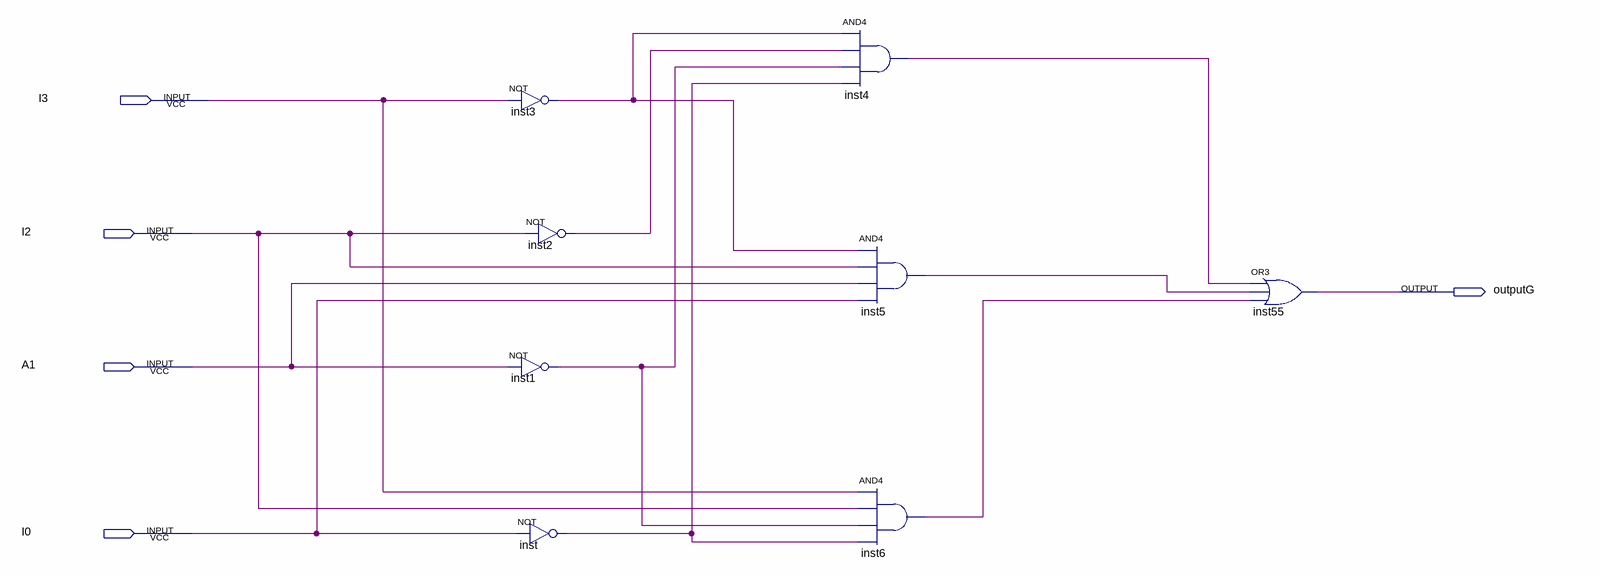
[diagram p0: schematic sheet]
// Quartus schematic outputG.bdf as structural Verilog: 8 symbols, 5 pins
module outputG (
  input  I3,
  input  I2,
  input  A1,
  input  I0,
  output outputG
);

  wire inst1_out, inst2_out, inst3_out, inst4_out, inst5_out, inst6_out, inst_out;

  not inst3 (inst3_out, I3);
  not inst2 (inst2_out, I2);
  not inst1 (inst1_out, A1);
  not inst (inst_out, I0);
  and inst4 (inst4_out, inst3_out, inst2_out, inst1_out, inst_out);
  and inst5 (inst5_out, inst3_out, I2, A1, I0);
  and inst6 (inst6_out, I3, I2, inst1_out, inst_out);
  or inst55 (outputG, inst4_out, inst5_out, inst6_out);
endmodule
